# EAGLE design SingleSide (EAGLE 6.2)
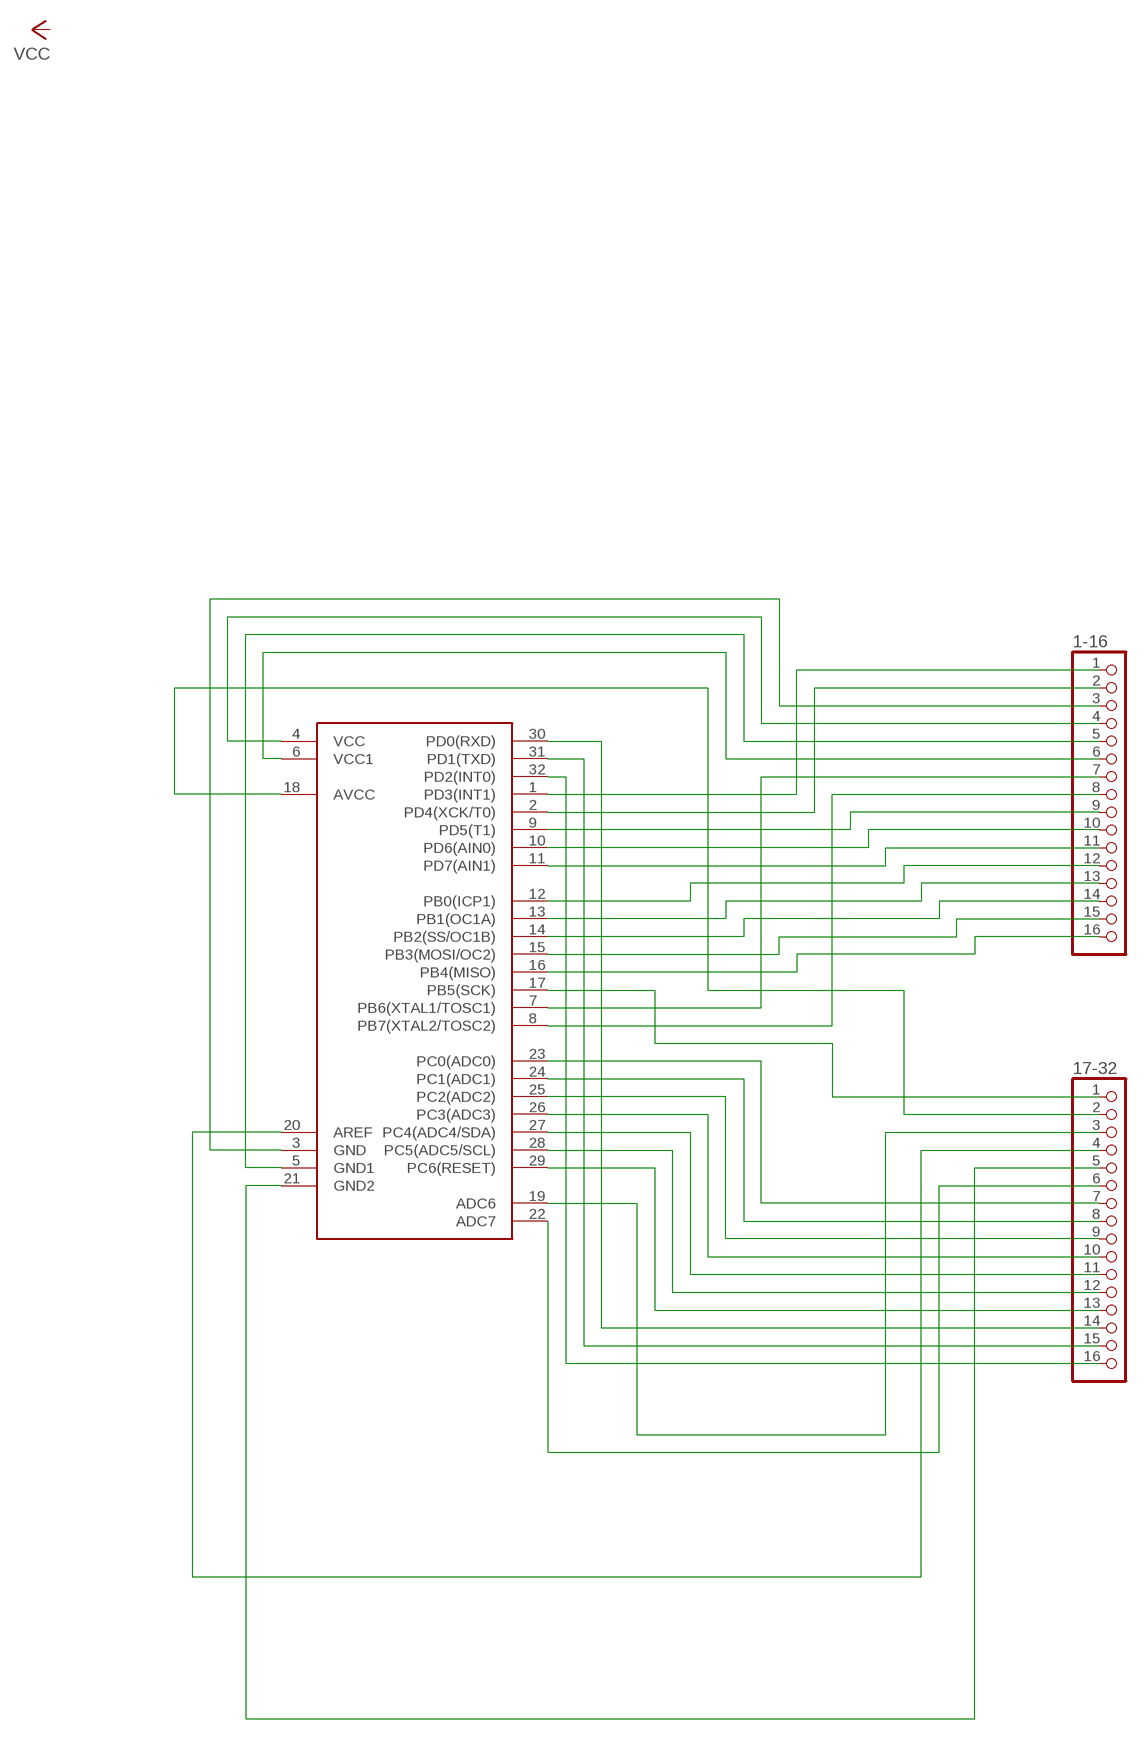
[diagram p0: schematic, sheet 1]

## Parts
1-16  PINHD-1X16  [1X16]
17-32  PINHD-1X16  [1X16]
U$1  ATMEGA8A  [TQFP32-08]

## Nets
N$2: 1-16.1 U$1.1(PD3(INT1))
N$3: 1-16.2 U$1.2(PD4(XCK/T0))
N$4: 1-16.3 U$1.3(GND)
N$5: 1-16.4 U$1.4(VCC)
N$6: 1-16.5 U$1.5(GND1)
N$7: 1-16.6 U$1.6(VCC1)
N$8: 1-16.7 U$1.7(PB6(XTAL1/TOSC1))
N$9: 1-16.8 U$1.8(PB7(XTAL2/TOSC2))
N$10: 1-16.9 U$1.9(PD5(T1))
N$11: 1-16.10 U$1.10(PD6(AIN0))
N$12: 1-16.11 U$1.11(PD7(AIN1))
N$13: 1-16.12 U$1.12(PB0(ICP1))
N$14: 1-16.13 U$1.13(PB1(OC1A))
N$15: 1-16.14 U$1.14(PB2(SS/OC1B))
N$16: 1-16.15 U$1.15(PB3(MOSI/OC2))
N$17: 1-16.16 U$1.16(PB4(MISO))
N$19: 17-32.2 U$1.18(AVCC)
N$20: 17-32.16 U$1.32(PD2(INT0))
N$22: 17-32.14 U$1.30(PD0(RXD))
N$23: 17-32.13 U$1.29(PC6(RESET))
N$25: 17-32.12 U$1.28(PC5(ADC5/SCL))
N$26: 17-32.11 U$1.27(PC4(ADC4/SDA))
N$27: 17-32.10 U$1.26(PC3(ADC3))
N$28: 17-32.9 U$1.25(PC2(ADC2))
N$29: 17-32.8 U$1.24(PC1(ADC1))
N$30: 17-32.7 U$1.23(PC0(ADC0))
N$31: 17-32.15 U$1.31(PD1(TXD))
N$32: 17-32.6 U$1.22(ADC7)
N$33: 17-32.3 U$1.19(ADC6)
N$34: 17-32.4 U$1.20(AREF)
N$35: 17-32.5 U$1.21(GND2)
N$36: 17-32.1 U$1.17(PB5(SCK))

## Library data of the parts
1-16 17-32 = pinhead:PINHD-1X16: PIN HEADER
U$1 = atmel:ATMEGA8A

## Board
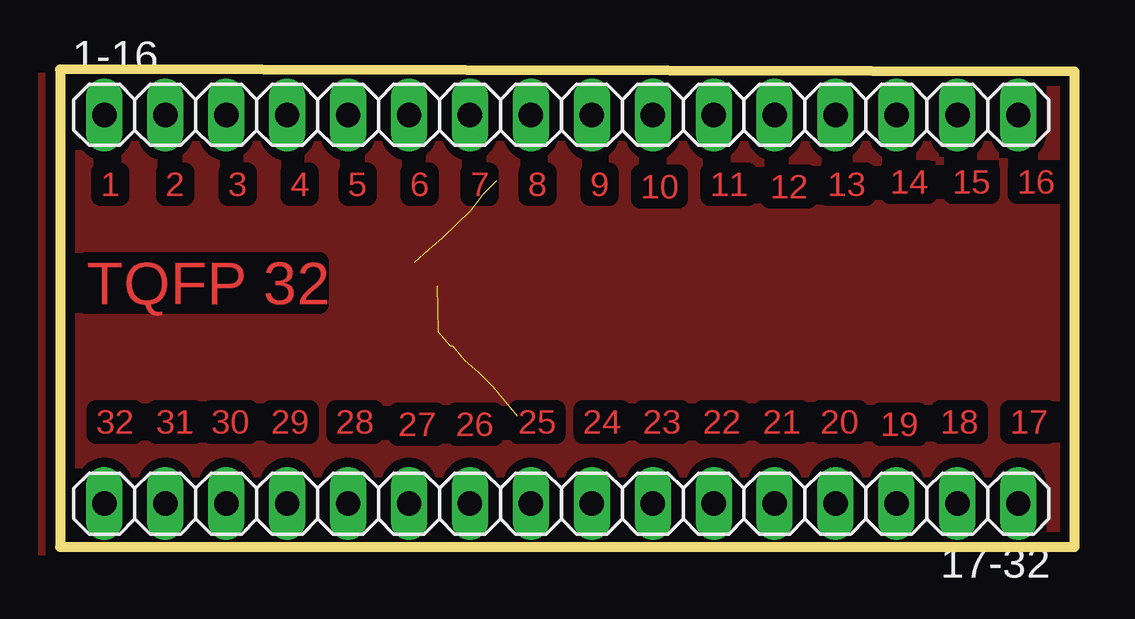
[diagram p1: board, top side]
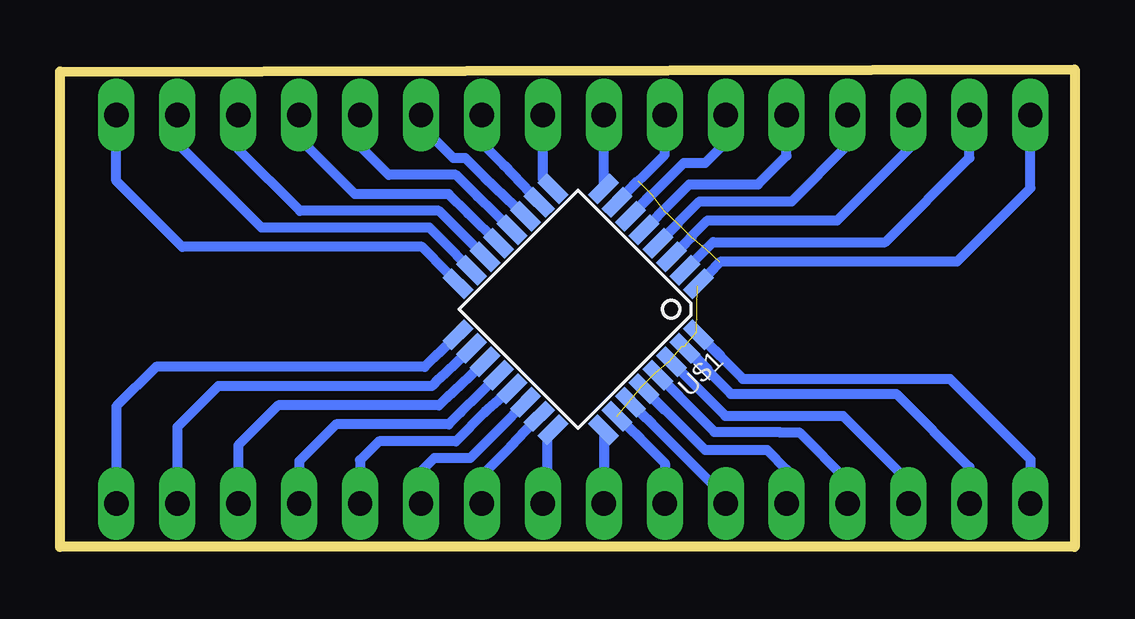
[diagram p2: board, bottom side, seen from below]

Size 42.3 x 19.9 mm. Coordinates in mm from the lower left corner, seen from the top.
Outline: 0,19.9 0,0 42.3,0 42.3,19.8 0,19.9
Copper layers (1*16): Top 0.035mm / dielectric 1.5mm / Bottom 0.035mm
Design rules: minimum track width 10mil, minimum drill 24mil, track to track 4mil, track to pad 4mil, pad to pad 8mil, via to via 8mil, smd to smd 8mil, copper to edge 10mil, drill to drill 8mil, minimum pad ring 10mil, minimum via ring 8mil, stop-mask expansion 4mil, vias tented up to drill 0mil, thermal gap 10mil

### Footprints (pad centres in the part's own frame; a part is rotated, then mirrored left to right if it is on the bottom)
1X16 = drill 1.016 long: 1 -19.05,0; 2 -16.51,0; 3 -13.97,0; 4 -11.43,0; 5 -8.89,0; 6 -6.35,0; 7 -3.81,0; 8 -1.27,0; 9 1.27,0; 10 3.81,0; 11 6.35,0; 12 8.89,0; 13 11.43,0; 14 13.97,0; 15 16.51,0; 16 19.05,0
TQFP32-08 = smd 1.27 x 0.559: 1 -4.293,2.8; 2 -4.293,2; 3 -4.293,1.2; 4 -4.293,0.4; 5 -4.293,-0.4; 6 -4.293,-1.2; 7 -4.293,-2; 8 -4.293,-2.8; 17 4.293,-2.8; 18 4.293,-2; 19 4.293,-1.2; 20 4.293,-0.4; 21 4.293,0.4; 22 4.293,1.2; 23 4.293,2; 24 4.293,2.8 | smd 0.559 x 1.27: 9 -2.8,-4.293; 10 -2,-4.293; 11 -1.2,-4.293; 12 -0.4,-4.293; 13 0.4,-4.293; 14 1.2,-4.293; 15 2,-4.293; 16 2.8,-4.293; 25 2.8,4.293; 26 2,4.293; 27 1.2,4.293; 28 0.4,4.293; 29 -0.4,4.293; 30 -1.2,4.293; 31 -2,4.293; 32 -2.8,4.293

### Placement (x,y rotation side)
1-16  20.9,18 0 top
17-32  20.9,1.8 180 top
U$1  20.7,9.9 225 bottom

### Tracks (layer width: path | path; a pad name or v marks a point on that pad's centre or on a via)
N$1
  pour Top (isolate 0.406): 0.3,19.7 42.3,19.7 42.3,-0.3 -0.7,-0.3 -0.7,19.7
N$2
  Bottom 0.406: U$1.1 14.74,11.9 4.9,11.9 1.85,14.95 1-16.1
N$3
  Bottom 0.406: U$1.2 15.07,12.7 7.9,12.7 4.39,16.21 1-16.2
N$4
  Bottom 0.406: U$1.3 15.3,13.6 9.9,13.6 6.93,16.57 1-16.3
N$5
  Bottom 0.406: U$1.4 15.63,14.4 11.8,14.4 9.47,16.73 1-16.4
N$6
  Bottom 0.406: U$1.5 16.07,15.1 13.2,15.1 12.01,16.29 1-16.5
N$7
  Bottom 0.406: U$1.6 16.3,16 15.4,16 14.55,16.85 1-16.6
N$8
  Bottom 0.406: U$1.7 17.09,16.34 1-16.7
N$9
  Bottom 0.406: U$1.8 1-16.8
N$10
  Bottom 0.406: U$1.9 22.17,15.33 1-16.9
N$11
  Bottom 0.406: U$1.10 23.8,15.9 24.71,16.81 1-16.10
N$12
  Bottom 0.406: U$1.11 24.6,15.4 25.4,16.2 25.9,16.2 27.25,17.55 1-16.11
N$13
  Bottom 0.406: U$1.12 24.9,14.6 25.8,15.5 28.6,15.5 29.79,16.69 1-16.12
N$14
  Bottom 0.406: U$1.13 25.3,13.9 26.1,14.7 30,14.7 32.33,17.03 1-16.13
N$15
  Bottom 0.406: U$1.14 25.8,13.3 26.5,14 32.3,14 34.87,16.57 1-16.14
N$16
  Bottom 0.406: U$1.15 26.4,12.8 26.9,13.3 33.9,13.3 37.41,16.81 1-16.15
N$17
  Bottom 0.406: 39.95,17.35 1-16.16 39.95,15.25 37.2,12.5 27.2,12.5 27,12.3 U$1.16
N$19
  Bottom 0.406: U$1.18 26.5,7 26.8,6.7 35.7,6.7 37.41,4.99 17-32.2
N$20
  Bottom 0.406: U$1.32 13.84,7 5.2,7 1.85,3.65 17-32.16
N$22
  Bottom 0.406: U$1.30 14.56,5.46 9.66,5.46 6.93,2.73 17-32.14
N$23
  Bottom 0.406: U$1.29 15.02,4.79 12.29,4.79 12.27,4.77 11.48,4.77 9.47,2.76 17-32.13
N$25
  Bottom 0.406: U$1.28 15.41,4.04 12.83,4.04 12.01,3.22 17-32.12
N$26
  Bottom 0.406: U$1.27 14.55,2.05 17-32.11
N$27  (14 unrouted)
  Bottom 0.406: U$1.26 18.1,4.5 17.09,3.49 17-32.10 | 18.58,6.05 17.6,5.1 | 18.08,6.65 17.1,5.7 | 17.48,7.25 16.5,6.3 | 16.88,7.75 15.9,6.8 | 16.28,8.35 15.3,7.4 | 15.78,8.95 14.77,7.99 | 16.38,8.35 15.4,7.4 | 14.78,11.87 15.73,10.89 | 15.38,12.41 16.33,11.43 | 15.97,12.9 16.92,11.92 | 16.55,13.46 17.5,12.48 | 17.14,14.03 18.09,13.05 | 17.64,14.69 18.59,13.71 | 18.2,15.25 19.15,14.27
N$28
  Bottom 0.406: U$1.25 17-32.9
N$29
  Bottom 0.406: U$1.24 22,4.64 22,1.3 22.17,1.47 17-32.8
N$30
  Bottom 0.406: U$1.23 23.5,4.2 24.71,2.99 17-32.7
N$31
  Bottom 0.406: U$1.31 14.34,6.37 7.44,6.37 4.39,3.32 17-32.15
N$32
  Bottom 0.406: U$1.22 24,4.9 25.2,3.7 26.7,3.7 27.25,3.15 17-32.6
N$33
  Bottom 0.406: U$1.19 26.2,6.2 26.5,5.9 33.2,5.9 34.87,4.23 17-32.3
N$34
  Bottom 0.406: U$1.20 25.6,5.6 26.1,5.1 30.8,5.1 32.33,3.57 17-32.4
N$35
  Bottom 0.406: U$1.21 24.6,5.6 25.8,4.4 29,4.4 29.79,3.61 17-32.5
N$36
  Bottom 0.406: U$1.17 26.7,7.9 27.1,7.5 38.3,7.5 39.95,5.85 17-32.1

### Text on the board
Top: 1 | 2 | 3 | 4 | 5 | 6 | 7 | 8 | 9 | 10 | 11 | 12 | 13 | 14 | 15 | 16 | TQFP 32 | 32 | 31 | 30 | 29 | 28 | 27 | 26 | 25 | 24 | 23 | 22 | 21 | 20 | 19 | 18 | 17